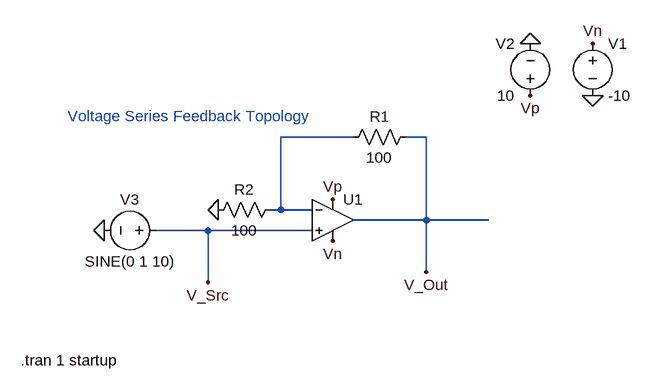
[diagram p0: schematic Voltage_Series_Feedback.asc]
Voltage_Series_Feedback.asc, the LTspice schematic file:
Version 4.1
SHEET 1 880 680
WIRE 336 112 224 112
WIRE 448 112 416 112
WIRE 224 224 224 112
WIRE 224 224 208 224
WIRE 272 224 224 224
WIRE 448 240 448 112
WIRE 448 240 336 240
WIRE 544 240 448 240
WIRE 112 256 32 256
WIRE 272 256 112 256
WIRE 448 320 448 240
WIRE 112 336 112 256
FLAG 704 48 0
FLAG 608 -32 0
FLAG 448 320 V_Out
FLAG 112 336 V_Src
FLAG -48 256 0
FLAG 128 224 0
FLAG 608 48 Vp
FLAG 304 208 Vp
FLAG 704 -32 Vn
FLAG 304 272 Vn
SYMBOL voltage 704 -48 R0
WINDOW 123 0 0 Left 0
WINDOW 39 0 0 Left 0
SYMATTR InstName V1
SYMATTR Value -10
SYMBOL res 432 96 R90
WINDOW 0 0 56 VBottom 2
WINDOW 3 32 56 VTop 2
SYMATTR InstName R1
SYMATTR Value 100
SYMBOL voltage 608 64 R180
WINDOW 0 24 96 Left 2
WINDOW 3 24 16 Left 2
WINDOW 123 0 0 Left 0
WINDOW 39 0 0 Left 0
SYMATTR InstName V2
SYMATTR Value 10
SYMBOL OpAmps\\UniversalOpAmp2 304 240 R0
SYMATTR InstName U1
SYMBOL voltage 48 256 R90
WINDOW 0 -32 56 VBottom 2
WINDOW 3 32 56 VTop 2
WINDOW 123 0 0 Left 0
WINDOW 39 0 0 Left 0
SYMATTR InstName V3
SYMATTR Value SINE(0 1 10)
SYMBOL res 224 208 R90
WINDOW 0 0 56 VBottom 2
WINDOW 3 32 56 VTop 2
SYMATTR InstName R2
SYMATTR Value 100
TEXT -176 456 Left 2 !.tran 1 startup
TEXT -104 80 Left 2 ;Voltage Series Feedback Topology

The netlist it stands for:
* Voltage_Series_Feedback.asc
V1 Vn 0 -10
R1 V_Out N001 100
V2 Vp 0 10
X§U1 V_Src N001 Vp Vn V_Out level2 Avol=1Meg GBW=10Meg Slew=10Meg Ilimit=25m Rail=0 Vos=0 En=0 Enk=0 In=0 Ink=0 Rin=500Meg  ; pins In+ In- V+ V- OUT
V3 V_Src 0 SINE(0 1 10)
R2 N001 0 100
.tran 1 startup
* Voltage Series Feedback Topology
.lib UniversalOpAmp2.lib
.backanno
.end